# Altium schematic sheet M4F_MCU_Power.SchDoc: M4F_MCU_Power
size Letter; DrawnBy: D. Fusi; DocumentNumber: 3; Revision: DVT; SheetNumber: 3; SheetTotal: 7
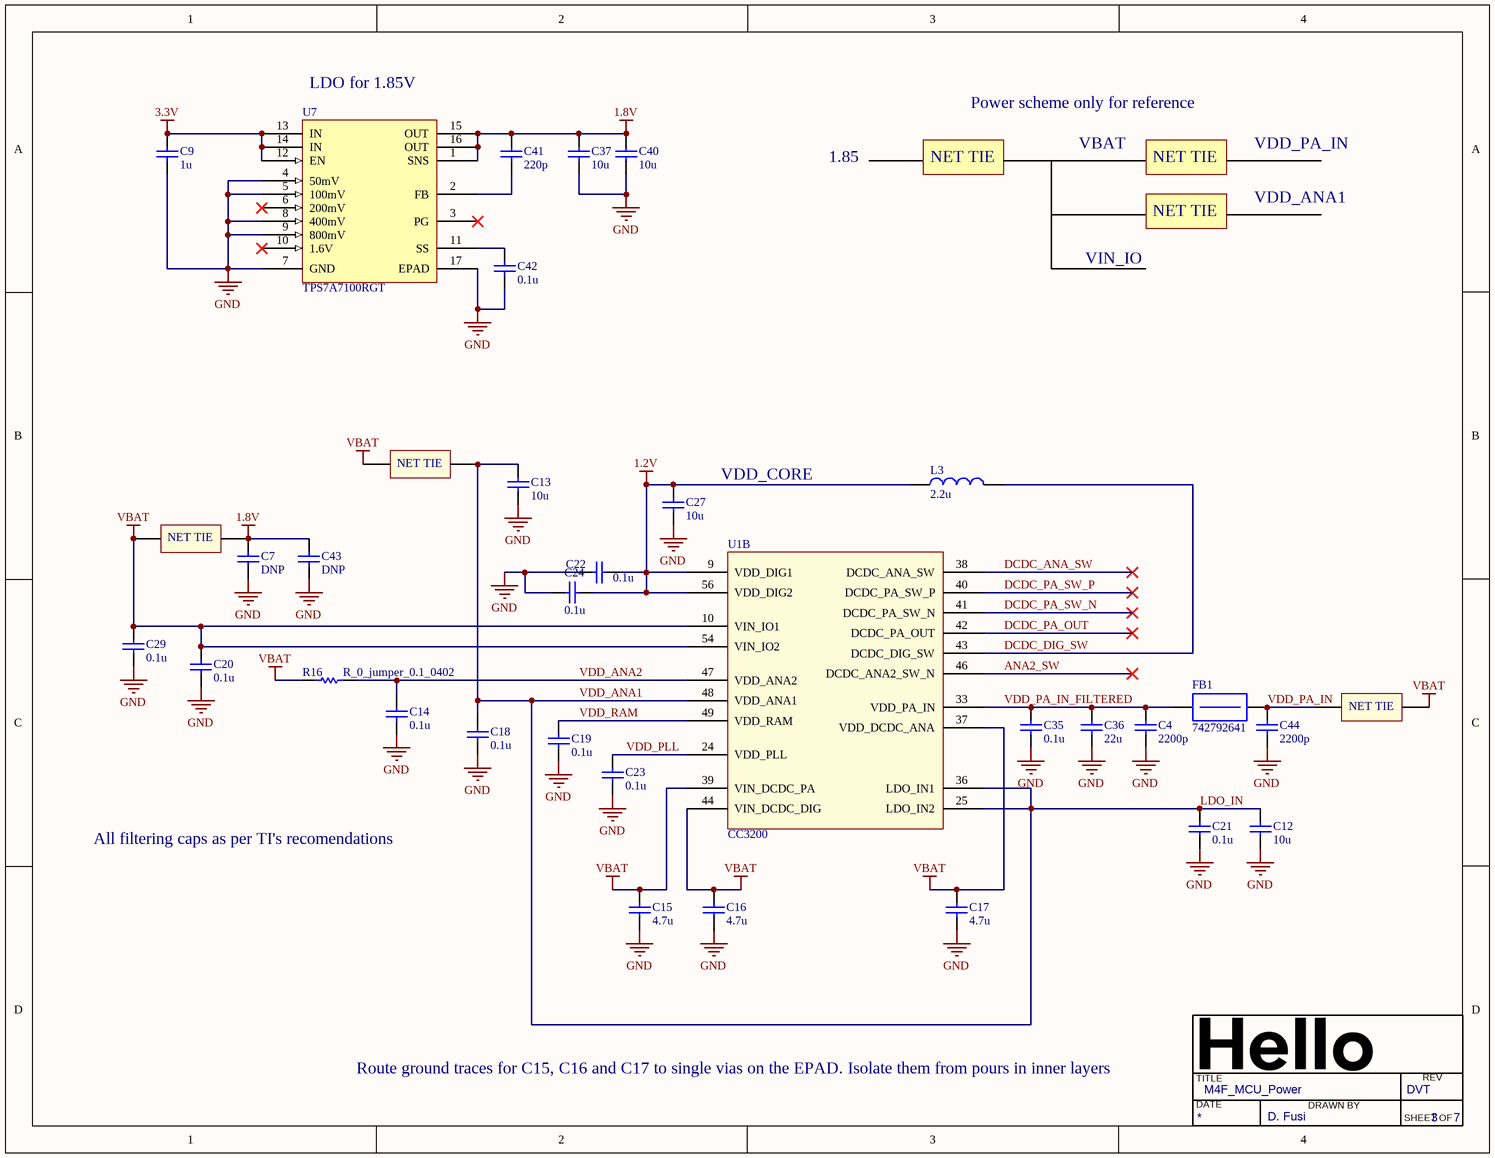
[diagram p0: M4F_MCU_Power.SchDoc]

## Parts
C4  2200p  [CAP0402_SENSE_DVT]
C7  DNP  [CAP1206_SENSE_DVT]
C9  1u  [CAP0603_SENSE_DVT]
C12  10u  [CAP0603_SENSE_DVT]
C13  10u  [CAP0603_SENSE_DVT]
C14  0.1u  [CAP0603_SENSE_DVT]
C15  4.7u  [CAP0603_SENSE_DVT]
C16  4.7u  [CAP0603_SENSE_DVT]
C17  4.7u  [CAP0603_SENSE_DVT]
C18  0.1u  [CAP0603_SENSE_DVT]
C19  0.1u  [CAP0603_SENSE_DVT]
C20  0.1u  [CAP0603_SENSE_DVT]
C21  0.1u  [CAP0603_SENSE_DVT]
C22  0.1u  [CAP0603_SENSE_DVT]
C23  0.1u  [CAP0603_SENSE_DVT]
C24  0.1u  [CAP0603_SENSE_DVT]
C27  10u  [CAP0603_SENSE_DVT]
C29  0.1u  [CAP0603_SENSE_DVT]
C35  0.1u  [CAP0603_SENSE_DVT]
C36  22u  [CAP0603_SENSE_DVT]
C37  10u  [CAP0805_SENSE_DVT]
C40  10u  [CAP0805_SENSE_DVT]
C41  220p  [CAP0402_SENSE_DVT]
C42  0.1u  [CAP0603_SENSE_DVT]
C43  DNP  [CAP1206_SENSE_DVT]
C44  2200p  [CAP0402_SENSE_DVT]
FB1  742792641  [RES0603_SENSE_DVT]
L3  2.2u  [IND_1008]
NT1  NT  [Net_tie_50mil]  (value not drawn)  (net tie, no BOM)
NT2  NT  [Net_tie_50mil]  (value not drawn)  (net tie, no BOM)
NT3  NT  [Net_tie_50mil]  (value not drawn)  (net tie, no BOM)
R16  R_0_jumper_0.1_0402  [RES0402-SENSE-DVT]
U1  CC3200  [QFN50P900X900X100_HS-65N]  (part B of 3)
U7  TPS7A7100RGT  [QFN50P300X300X100_HS-17N]

## Nets
1.2V: C22.2 C24.1 C27.2 L3.1 U1.9(VDD_DIG1) U1.56(VDD_DIG2)
1.8V: C7.2 C37.2 C40.2 C41.2 C43.2 NT2.2 U7.1(SNS) U7.15(OUT) U7.16(OUT)
3.3V: C9.2 U7.12(EN) U7.13(IN) U7.14(IN)
GND: C4.1 C7.1 C9.1 C12.1 C13.1 C14.1 C15.1 C16.1 C17.1 C18.1 C19.1 C20.1 C21.1 C22.1 C23.1 C24.2 C27.1 C29.1 C35.1 C36.1 C37.1 C40.1 C42.1 C43.1 C44.1 U7.4(50mV) U7.5(100mV) U7.7(GND) U7.8(400mV) U7.9(800mV) U7.17(EPAD)
VBAT: C15.2 C16.2 C17.2 C20.2 C29.2 NT1.1 NT2.1 NT3.2 R16.1 U1.10(VIN_IO1) U1.37(VDD_DCDC_ANA) U1.39(VIN_DCDC_PA) U1.44(VIN_DCDC_DIG) U1.54(VIN_IO2)
ANA2_SW: U1.46(DCDC_ANA2_SW_N)
DCDC_ANA_SW: U1.38(DCDC_ANA_SW)
DCDC_DIG_SW: L3.2 U1.43(DCDC_DIG_SW)
DCDC_PA_OUT: U1.42(DCDC_PA_OUT)
DCDC_PA_SW_N: U1.41(DCDC_PA_SW_N)
DCDC_PA_SW_P: U1.40(DCDC_PA_SW_P)
LDO_IN: C12.2 C13.2 C18.2 C21.2 NT1.2 U1.25(LDO_IN2) U1.36(LDO_IN1) U1.48(VDD_ANA1)  [also labelled VDD_ANA1]
VDD_ANA2: C14.2 R16.2 U1.47(VDD_ANA2)
VDD_PA_IN: C44.2 FB1.2 NT3.1
VDD_PA_IN_FILTERED: C4.2 C35.2 C36.2 FB1.1 U1.33(VDD_PA_IN)
VDD_PLL: C23.2 U1.24(VDD_PLL)
VDD_RAM: C19.2 U1.49(VDD_RAM)
NetC41_1: C41.1 U7.2(FB)
NetC42_2: C42.2 U7.11(SS)

Not connected (* = marked no-connect by the designer): U7 3(PG)* 6(200mV)* 10(1.6V)*

## Notes on the sheet
- (near U7) LDO for 1.85V
- 1.85
- NET TIE
- Power scheme only for reference
- VBAT
- VDD_PA_IN
- VDD_ANA1
- VIN_IO
- (near C27) VDD_CORE
- All filtering caps as per TI's recomendations
- Route ground traces for C15, C16 and C17 to single vias on the EPAD. Isolate them from pours in inner layers
- TITLE
- DATE
- DRAWN BY
- REV
- SHEET
- OF
- (in symbol Net tie_50mil) NET TIE

## Library data of the parts
C4 C44 = C_2200p_5_16_STD_0402: Chip capacitor; Vendor: Taiyo Yuden; PN: EMK105SD222JV-F; Tolerance: 5 %; Voltage: 16V; Temp: Standard; Hello_PN: 225-00417; Value: 2200p; Size: 0402; item_category: Capacitor
C7 C43 = C_100u_20_6.3_X5R_1206: Chip capacitor; Value: 100u; Vendor: TDK; PN: C3216X5R0J107M160AB; Tolerance: 20%; Voltage: 6.3V; Temp: X5R; Hello_PN: 225-00043; Size: 1206; item_category: Capacitor
C9 = C_1u_10_16_X5R_0603: Chip capacitor; Vendor: TDK; PN: C0603C105K4PACTU; Tolerance: 10%; Voltage: 16V; Temp: X5R; Hello_PN: 225-00057; Value: 1u; Size: 0603; item_category: Capacitor
C12 C13 C27 = C_10u_10_6.3_X5R_0603: Chip capacitor; Vendor: TDK; PN: C1608X5R0J106K080AB; Tolerance: 10%; Voltage: 6.3V; Temp: X5R; Hello_PN: 225-00415; Value: 10u; Size: 0603; item_category: Capacitor
C14 C18-C24 C29 C35 C42 = C_0.1u_20_16_X7R_0603: Chip capacitor; Vendor: Samsung; PN: CL10B104MO8NNNC; Tolerance: 20%; Voltage: 16V; Temp: X7R; Hello_PN: 225-00235; Value: 0.1u; Size: 0603
C15-C17 = C_4.7u_20_10_X5R_0603: Chip capacitor; Vendor: TDK; PN: CGB3B1X5R1A475M055AC; Tolerance: 20%; Voltage: 10V; Temp: X5R; Hello_PN: 225-00050; Value: 4.7u; Size: 0603; item_category: Capacitor
C36 = C_22u_10_20_JB_0603: Chip capacitor; Vendor: TDK; PN: C1608JB1A226M080AC; Tolerance: 20%; Voltage: 10V; Temp: JB; Value: 22u; Size: 0603
C37 C40 = C_10u_20_10_X7R_0805: Chip capacitor; Vendor: TDK; PN: LMK212AB7106MG-T; Tolerance: 20%; Voltage: 10V; Temp: X7R; Hello_PN: 225-00413; Value: 10u; Size: 0805; item_category: Capacitor
C41 = C_220p_5_50_NP0_0402: Chip capacitor; Vendor: Murata; PN: GRM1555C1H221JA01D; Tolerance: 5%; Voltage: 50V; Temp: NP0; Hello_PN: 225-00329; Value: 220p; Size: 0402; item_category: Capacitor
FB1 = FB_300_2_0.15_0603: Ferrite bead, 300 ohm impedance; Vendor: Wuerth; impedance at 100 MHz: 300; rated current: 2 A; DCR: 0.15 ohm; Hello_PN: 231-00206; PN: 742792641; item_category: Ferrite Bead
L3 = L_2.2u_20_?_0.08_?_1.3: SMD power inductor, 2.2uH; PN: LQM2HPN2R2MG0; Vendor: Murata; Tolerance: 20%; RDC: 0.08; I_max: 1.3; Hello_PN: 230-00316; Value: 2.2u; Q: ?; I_sat: ?; item_category: Inductor
NT1-NT3 = Net tie_50mil: Net tie to bridge 50 mil spacing connector holes
R16 = R_0_jumper_0.1_0402: Chip Resistor; Value: 0; Vendor: Panasonic; Tolerance: Jumper; Power: 0.1 W; PN: ERJ-2GE0R00X; Hello_PN: 220-00408; Model: *; Size: 0402; item_category: Resistor
U1 = CC3200: TI Wi-FI module; Hello_PN: 265-00252; item_category: IC Mixed Signal; Vendor: TI; PN: CC3200
U7 = TPS7A7100RGT: 1A fast-transient LDO; Vendor: TI; Hello_PN: 260-00035; item_category: IC_Digital; PN: TPS7A7100RGT